# Altium schematic sheet Sheet.SchDoc
size 840 x 594 mm; Address1: Address1; Address2: Address2; Address3: Address3; Address4: Address4; SheetNumber: 1; Scale: 1:1; Разраб.: Иванов; Обозначение документа: АБВГ.123456.001 Э3; Пров.: Петров; Утв.: Сидоров; Наименование организации: ОАО "Концерн "МПО-Гидроприбор"; Перв. применение: АБВГ.123456.000; Наименование изделия 1: Плата; Наименование изделия 2: Схема электрическая; Наименование изделия 3: принципиальная; Нач. отд.: Нач. отд.; Фамилия нач. отд.: Сидоров
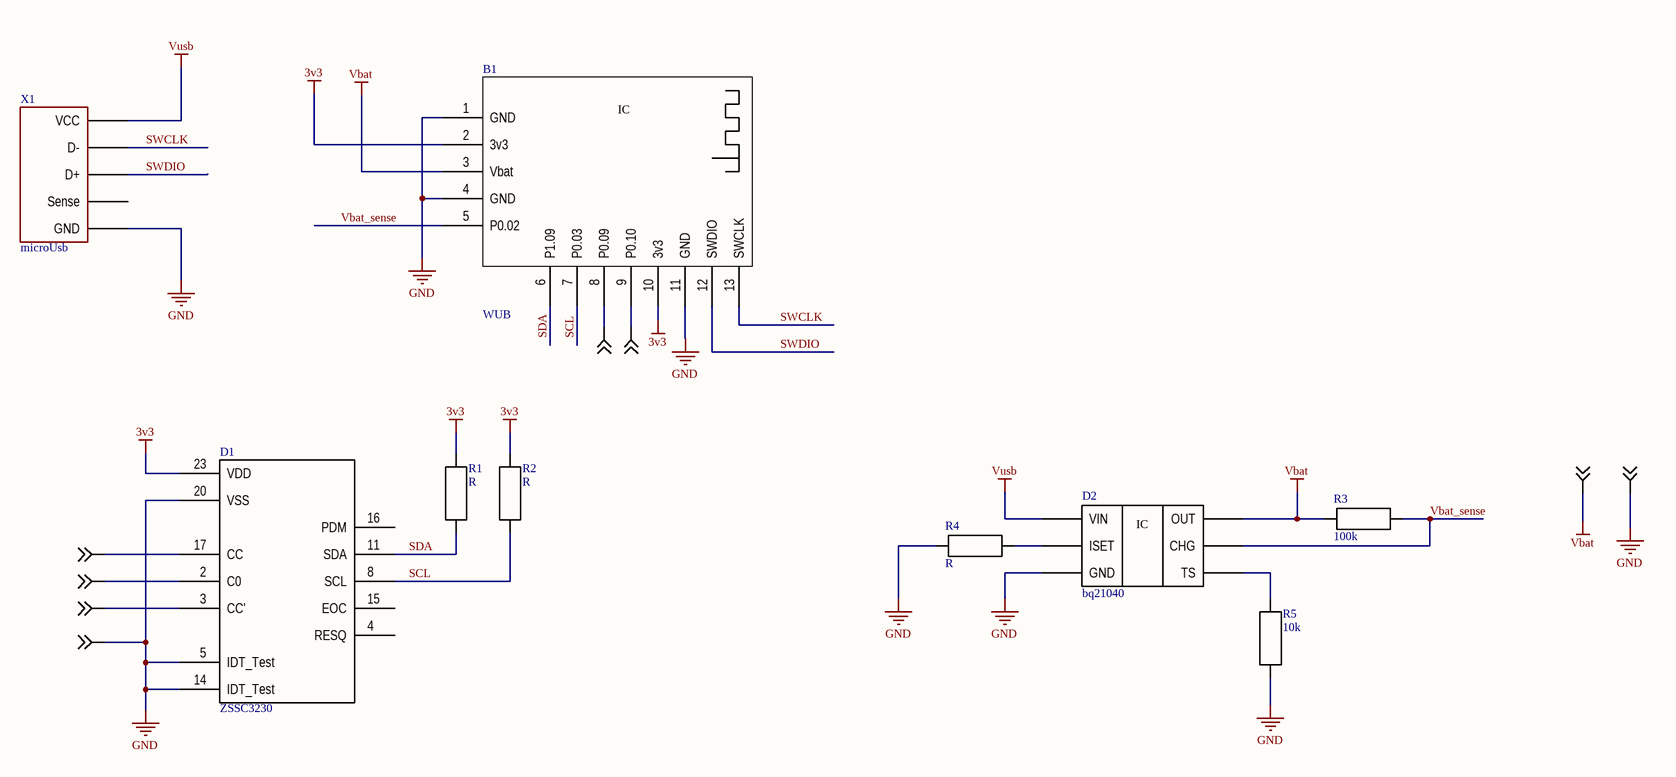
[diagram p0: Sheet.SchDoc]

## Parts
B1  WUB  [WUB_01]
D1  ZSSC3230  [QFN24]
D2  bq21040  [SOT-23]
R1  R  [R0402]
R2  R  [R0402]
R3  100k  [R0402]
R4  R  [R0402]
R5  10k  [R0402]
X1  microUsb  [10118194-0001LF]
X2  PinConnect  [PinConnect2]  (value not drawn)
X3  PinConnect  [PinConnect2]  (value not drawn)
X4  PinConnect  [PinConnect2]  (value not drawn)
X5  PinConnect  [PinConnect2]  (value not drawn)
X6  PinConnect  [PinConnect2]  (value not drawn)
X7  PinConnect  [PinConnect2]  (value not drawn)
X8  PinConnect  [PinConnect2]  (value not drawn)
X9  PinConnect  [PinConnect2]  (value not drawn)

## Nets
3v3: B1.2(3v3) B1.10(3v3) D1.23(VDD) R1.2 R2.2
GND: B1.1(GND) B1.4(GND) B1.11(GND) D1.5(IDT_Test) D1.14(IDT_Test) D1.20(VSS) D2.5(GND) R4.1 R5.1 X1.5(GND) X5.1 X9.1
Vbat: B1.3(Vbat) D2.2(OUT) R3.1 X4.1
Vusb: D2.6(VIN) X1.1(VCC)
SCL: B1.7(P0.03) D1.8(SCL) R2.1
SDA: B1.6(P1.09) D1.11(SDA) R1.1
SWCLK: B1.13(SWCLK) X1.2(D-)
SWDIO: B1.12(SWDIO) X1.3(D+)
Vbat_sense: B1.5(P0.02) D2.3(CHG) R3.2
NetB1_8: B1.8(P0.09) X2.1
NetB1_9: B1.9(P0.10) X3.1
NetD1_2: D1.2(C0) X7.1
NetD1_3: D1.3(CC') X8.1
NetD1_17: D1.17(CC) X6.1
NetD2_1: D2.1(TS) R5.2
NetD2_4: D2.4(ISET) R4.2

Not connected (* = marked no-connect by the designer): D1 4(RESQ) 15(EOC) 16(PDM); X1 4(Sense)

## Notes on the sheet
- Перв. примен.
- Справ. №
- Подп. и дата
- Инв. № дубл.
- Взам. инв. №
- Разраб.
- Изм.
- Лист
- № докум.
- Подп.
- Дата
- Лит.
- Масса
- Масштаб
- Пров.
- Т.контр.
- Листов
- Инв. № подл.
- Утв.
- Н.контр.
- Копировал
- Формат А1
- (in symbol bq21040) IC
- (in symbol WUB) IC

## Library data of the parts
R3 R5 = R